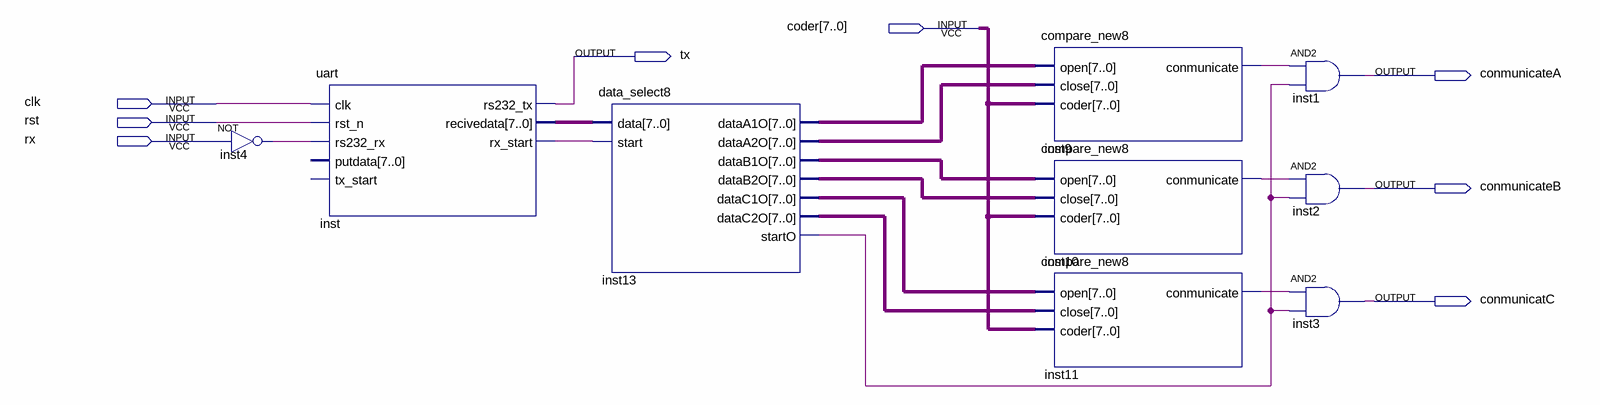
[diagram p0: schematic sheet]
// Quartus schematic main_new8.bdf as structural Verilog: 9 symbols, 8 pins
module main_new8 (
  input  [7:0] coder,
  input  clk,
  input  rst,
  input  rx,
  output tx,
  output conmunicateA,
  output conmunicateB,
  output conmunicatC
);

  wire inst4_out, inst9_conmunicate, inst10_conmunicate, inst11_conmunicate, inst13_starto, inst_rx_start;
  wire [7:0] inst13_dataa1o, inst13_dataa2o, inst13_datab1o, inst13_datab2o, inst13_datac1o, inst13_datac2o,
       inst_recivedata;

  not inst4 (inst4_out, rx);
  uart inst (
    .clk(clk), .rst_n(rst), .rs232_rx(inst4_out), .rs232_tx(tx), .recivedata(inst_recivedata),
    .rx_start(inst_rx_start));  // open: putdata, tx_start
  data_select8 inst13 (
    .data(inst_recivedata), .start(inst_rx_start), .dataA1O(inst13_dataa1o), .dataA2O(inst13_dataa2o),
    .dataB1O(inst13_datab1o), .dataB2O(inst13_datab2o), .dataC1O(inst13_datac1o), .dataC2O(inst13_datac2o),
    .startO(inst13_starto));
  compare_new8 inst9 (.open(inst13_dataa1o), .close(inst13_dataa2o), .coder(coder), .conmunicate(inst9_conmunicate));
  compare_new8 inst10 (.open(inst13_datab1o), .close(inst13_datab2o), .coder(coder), .conmunicate(inst10_conmunicate));
  compare_new8 inst11 (.open(inst13_datac1o), .close(inst13_datac2o), .coder(coder), .conmunicate(inst11_conmunicate));
  and inst1 (conmunicateA, inst9_conmunicate, inst13_starto);
  and inst2 (conmunicateB, inst10_conmunicate, inst13_starto);
  and inst3 (conmunicatC, inst11_conmunicate, inst13_starto);
endmodule
